# EAGLE schematic TH3122_to_RS232 (EAGLE 7.2.0)
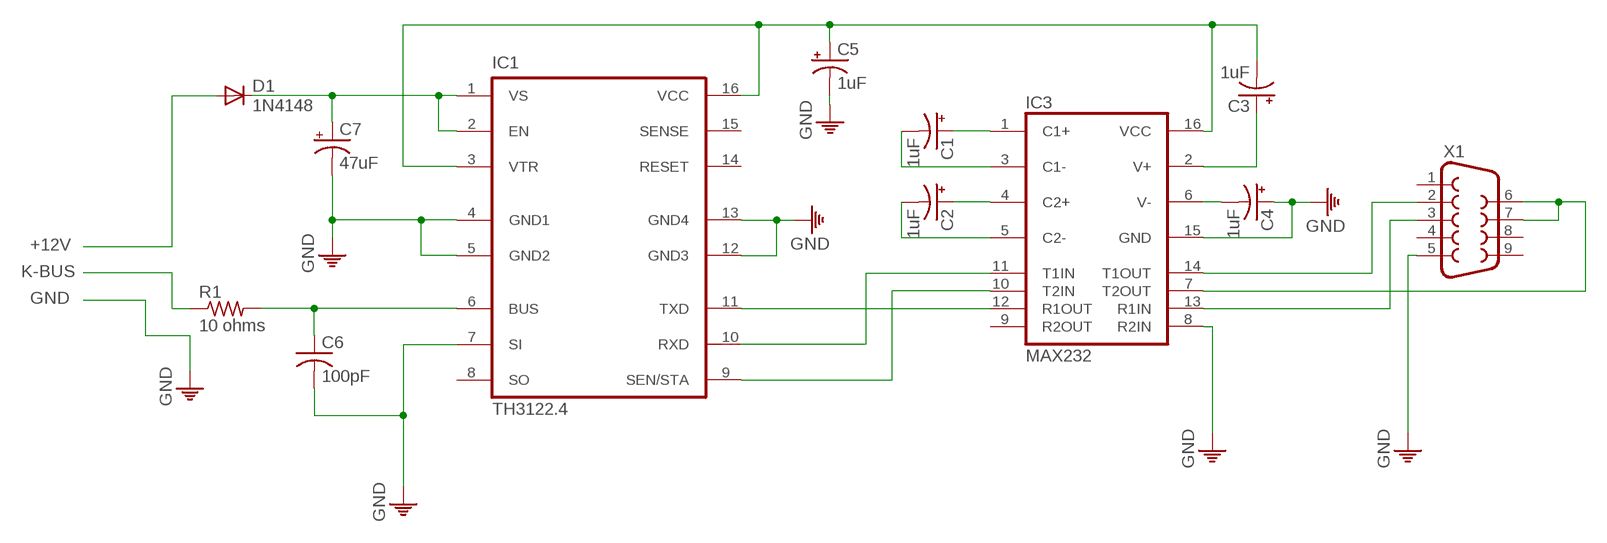
[diagram p0: schematic, sheet 1]

## Parts
C1  1uF  CPOL-USA  [PANASONIC_A]
C2  1uF  CPOL-USA  [PANASONIC_A]
C3  1uF  CPOL-USA  [PANASONIC_A]
C4  1uF  CPOL-USA  [PANASONIC_A]
C5  1uF  CPOL-USA  [PANASONIC_A]
C6  100pF  C-US025-030X050  [C025-030X050]
C7  47uF  CPOL-USA  [PANASONIC_A]
D1  1N4148  1N4148DO35-10  [DO35-10]
IC1  TH3122.4  [TH3122]
IC3  MAX232  [DIL16]
R1  10 ohms  R-US_0204/5  [0204/5]
X1  F09HP  [F09HP]

## Nets
+12V: D1.A
GND: C4.+ C5.- C6.2 C7.- IC1.4(GND1) IC1.5(GND2) IC1.7(SI) IC1.12(GND3) IC1.13(GND4) IC3.8(R2IN) IC3.15(GND) X1.5
K-BUS: R1.1
N$1: C2.+ IC3.4(C2+)
N$2: C1.+ IC3.1(C1+)
N$3: C6.1 IC1.6(BUS) R1.2
N$5: C2.- IC3.5(C2-)
N$6: C4.-
N$7: C3.- C5.+ IC1.3(VTR) IC1.16(VCC) IC3.16(VCC)
N$8: C3.+ IC3.2(V+)
N$9: IC3.7(T2OUT) X1.6 X1.7
N$11: IC1.9(SEN/STA) IC3.10(T2IN)
N$12: IC1.11(TXD) IC3.12(R1OUT)
N$13: IC1.10(RXD) IC3.11(T1IN)
N$14: C1.- IC3.3(C1-)
N$15: IC3.14(T1OUT) X1.2
N$16: IC3.13(R1IN) X1.3
N$21: C7.+ D1.C IC1.1(VS) IC1.2(EN)
Unconnected: IC1.8(SO) IC1.14(RESET) IC1.15(SENSE) IC3.6(V-) IC3.9(R2OUT) X1.1 X1.4 X1.8 X1.9

## Library data of the parts
C1-C5 C7 = resistor:CPOL-US: POLARIZED CAPACITOR, American symbol
C6 = resistor:C-US: CAPACITOR, American symbol
D1 = diode:1N4148: DIODE high speed (Philips)
IC1 = BMW_K-Bus:TH3122: TH3122.4
IC3 = melexis_th3122:MAX232: RS232 TRANSCEIVER; MF: MAXIM; MPN: MAX232ACPE+; OC_FARNELL: 9723773; OC_NEWARK: 68K4544
R1 = resistor:R-US_: RESISTOR, American symbol
X1 = con-subd:F09: SUB-D; OC_FARNELL: unknown; OC_NEWARK: unknown